# EasyEDA schematic SCH_Smart-Flower_2024-08-20 (easyeda STD).json
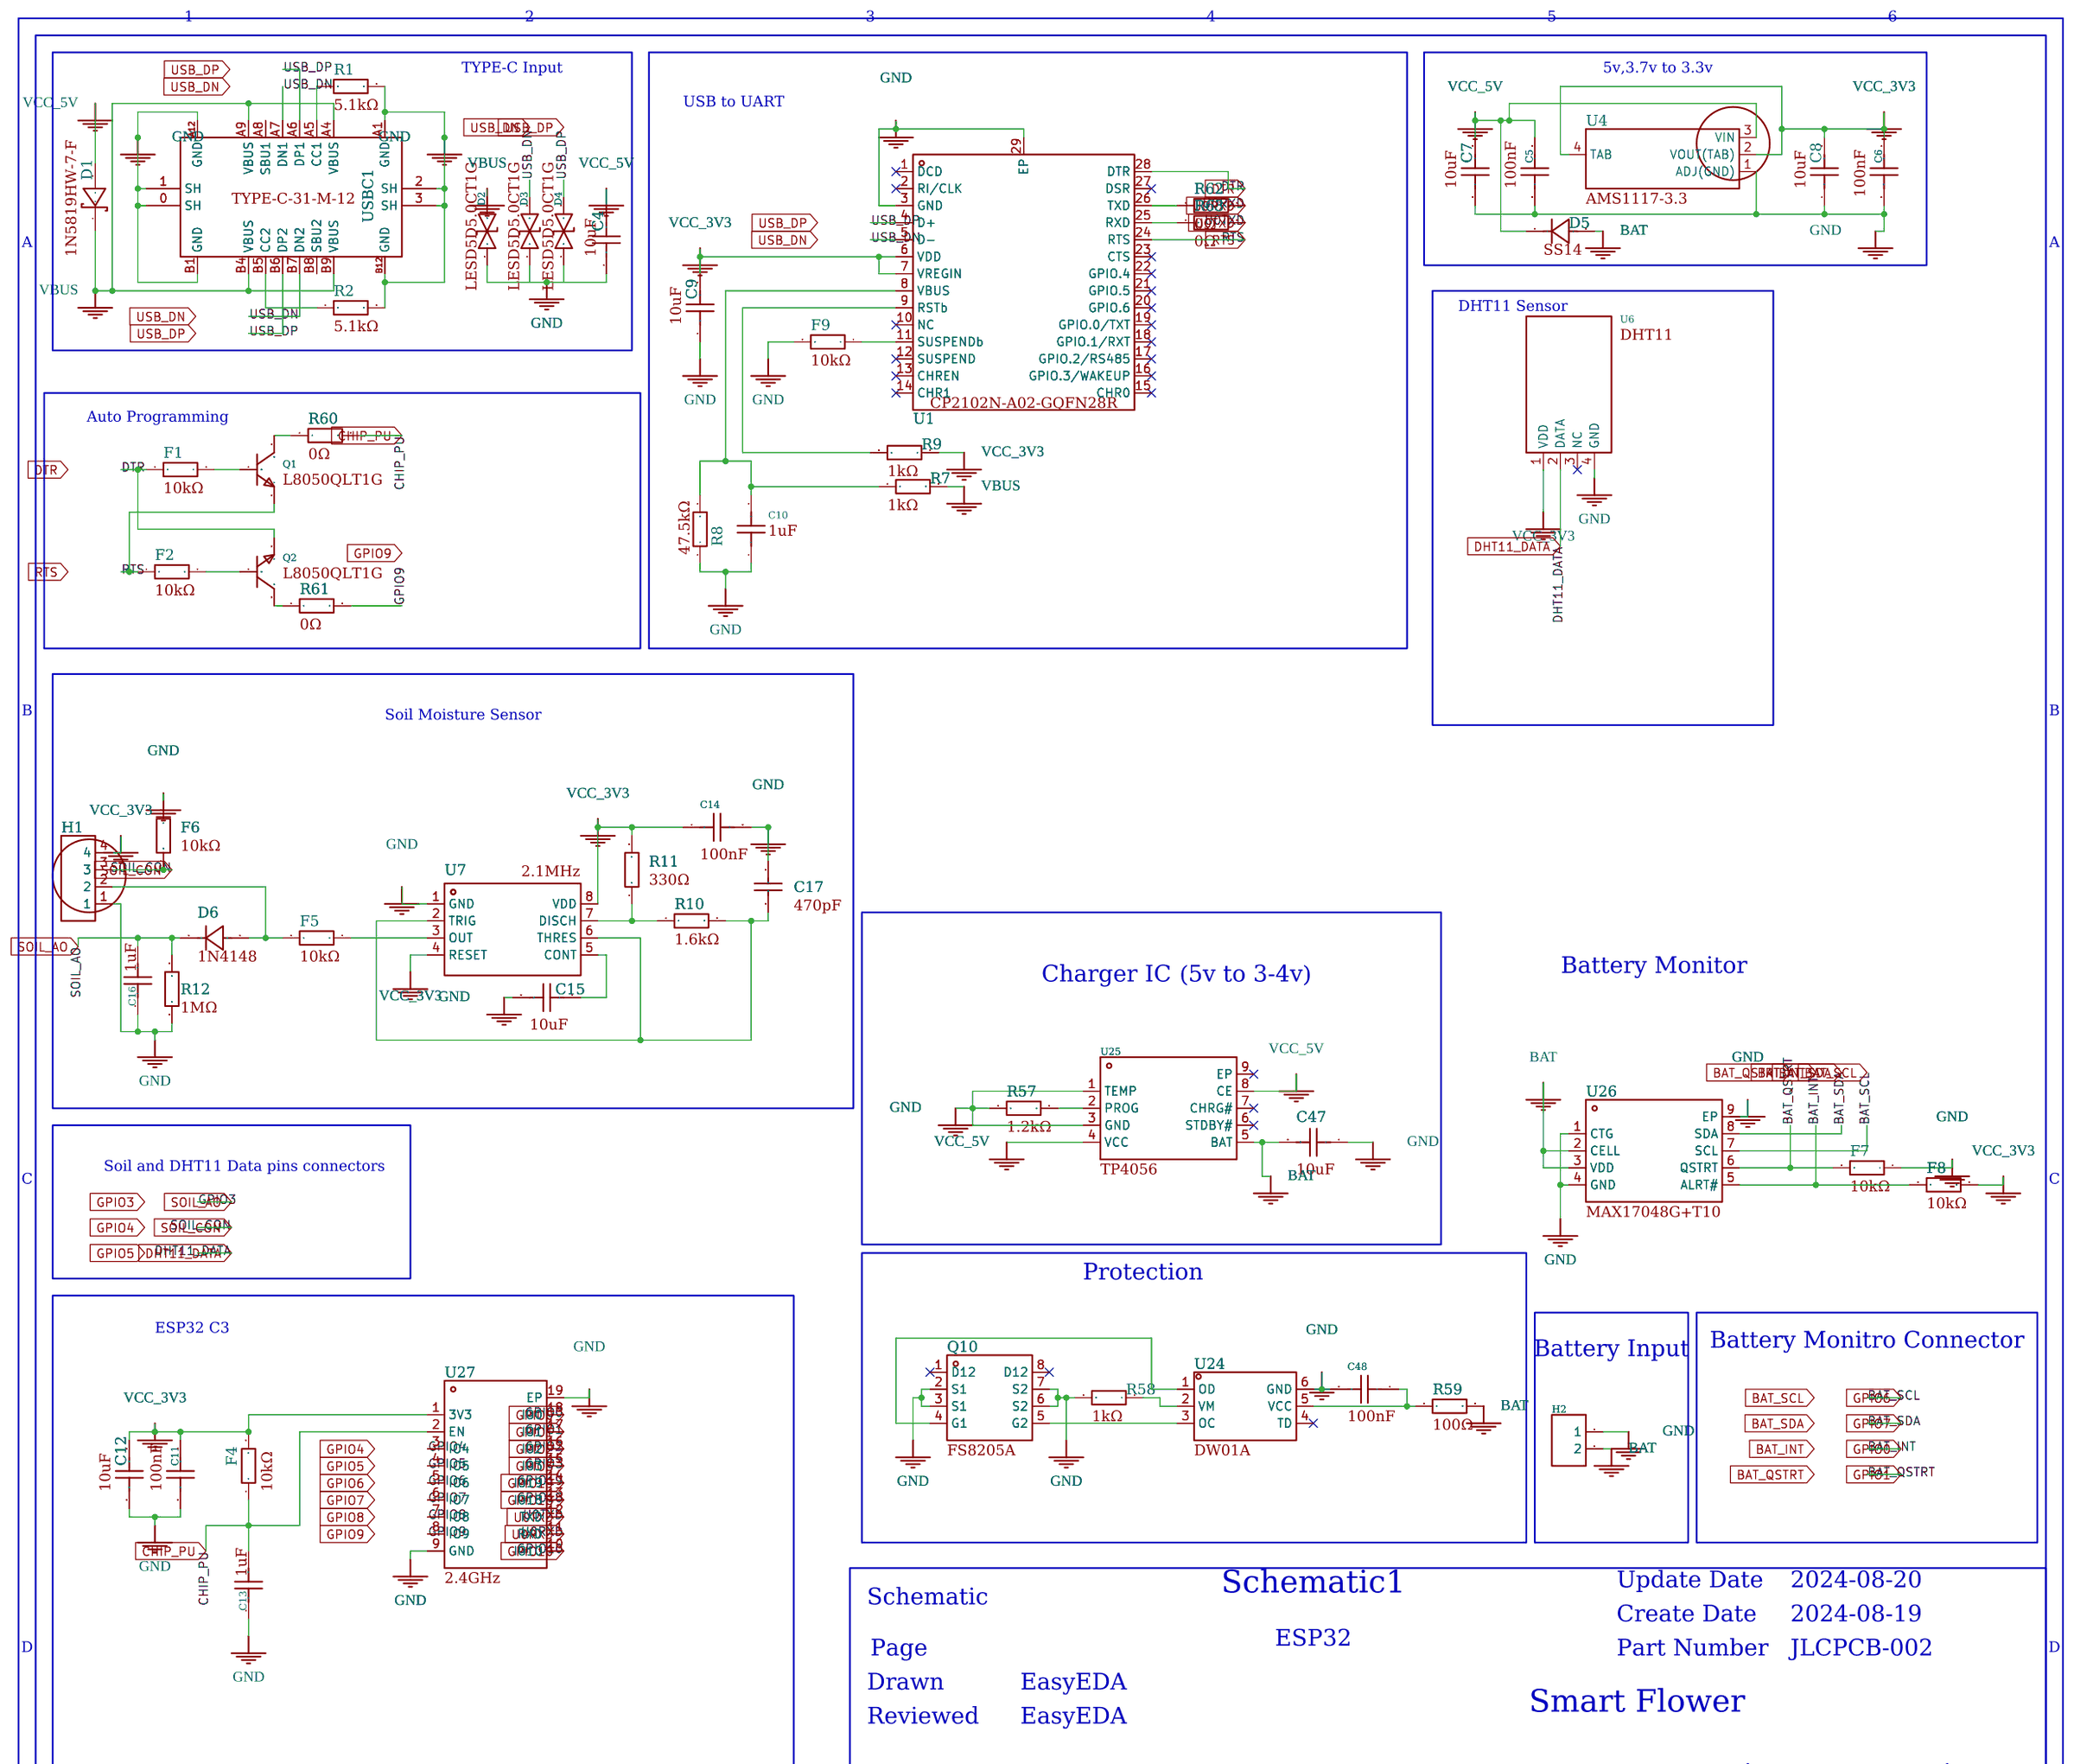
[diagram p0: schematic sheet]

## Parts
C4  10uF  [0]
C5  100nF  [0]
C6  100nF  [0]
C7  10uF  [0]
C8  10uF  [0]
C9  10uF  [0]
C10  1uF  [0]
C11  100nF  [0]
C12  10uF  [0]
C13  1uF  [0]
C14  100nF  [0]
C15  10uF  [0]
C16  1uF  [0]
C17  470pF  [0]
C47  10uF  [0]
C48  100nF  [0]
D1  1N5819HW-7-F  [0]
D2  LESD5D5.0CT1G  [0]
D3  LESD5D5.0CT1G  [0]
D4  LESD5D5.0CT1G  [0]
D5  SS14  [0]
D6  1N4148  [0]
F1  10kΩ  [0]
F2  10kΩ  [0]
F4  10kΩ  [0]
F5  10kΩ  [0]
F6  10kΩ  [0]
F7  10kΩ  [0]
F8  10kΩ  [0]
F9  10kΩ  [0]
H1  HDR-M_2.54_1x4P  [0]
H2  HDR-F_2.54_1x2P  [0]
Q1  L8050QLT1G  [0]
Q2  L8050QLT1G  [0]
Q10  FS8205A  [0]
R1  5.1kΩ  [0]
R2  5.1kΩ  [0]
R7  1kΩ  [0]
R8  47.5kΩ  [0]
R9  1kΩ  [0]
R10  1.6kΩ  [0]
R11  330Ω  [0]
R12  1MΩ  [0]
R57  1.2kΩ  [0]
R58  1kΩ  [0]
R59  100Ω  [0]
R60  0Ω  [0]
R61  0Ω  [0]
R62  0Ω  [0]
R63  0Ω  [0]
U1  CP2102N-A02-GQFN28R  [0]
U4  AMS1117-3.3  [0]
U6  DHT11  [0]
U7  2.1MHz  [0]
U24  DW01A  [0]
U25  TP4056  [0]
U26  MAX17048G+T10  [0]
U27  2.4GHz  [0]
USBC1  TYPE-C-31-M-12  [0]

## Library data of the parts
C4 C7-C9 C12 C15 C47 = -: Capacitance: Tolerance:±20% Tolerance:±20% Voltage Rated: Temperature Coefficient:; Symbol: 0603X106M250NT; Device: CL10A106MA8NRNC; LCSC Part Name: 10uF ±20% 25V; Supplier Part: C96446; Manufacturer: SAMSUNG(三星); Manufacturer Part: CL10A106MA8NRNC; Supplier Footprint: 0603; JLCPCB Part Class: Basic Part; Datasheet: https://atta.szlcsc.com/upload/public/pdf/source/20160218/1457707763339.pdf; Supplier: LCSC; Add into BOM: yes; Convert to PCB: yes; Tolerance: ±20%
C5 C6 C11 C14 C48 = -: Capacitance: Tolerance:±10% Tolerance:±10% Voltage Rated: Temperature Coefficient:; Symbol: CT41G-0805-2X1-50V-0.1UF-K(N); Device: CL21B104KCFNNNE; Supplier: LCSC; Supplier Part: C28233; Manufacturer: SAMSUNG(三星); Manufacturer Part: CL21B104KCFNNNE; JLCPCB Part Class: Basic Part; LCSC Part Name: 100nF ±10% 100V; Supplier Footprint: 0805; Datasheet: https://atta.szlcsc.com/upload/public/pdf/source/20160218/1457707763339.pdf; Add into BOM: yes; Convert to PCB: yes; Tolerance: ±10%
C10 C13 C16 = -: Capacitance: Tolerance:±10% Tolerance:±10% Voltage Rated: Temperature Coefficient:; Symbol: GRM188R71E105KA12D; Device: CL10A105KB8NNNC; Supplier: LCSC; Manufacturer: SAMSUNG(三星); Manufacturer Part: CL10A105KB8NNNC; Supplier Part: C15849; JLCPCB Part Class: Basic Part; LCSC Part Name: 1uF ±10% 50V; Supplier Footprint: 0603; Datasheet: https://atta.szlcsc.com/upload/public/pdf/source/20160218/1457707763339.pdf; Add into BOM: yes; Convert to PCB: yes; Tolerance: ±10%
C17 = -: Capacitance: Tolerance:±10% Tolerance:±10% Voltage Rated: Temperature Coefficient:; Symbol: 0603B471K101NT; Device: 0603B471K500NT; LCSC Part Name: 470pF ±10% 50V; Supplier Part: C1620; Manufacturer: FH(风华); Manufacturer Part: 0603B471K500NT; Supplier Footprint: 0603; JLCPCB Part Class: Basic Part; Datasheet: https://atta.szlcsc.com/upload/public/pdf/source/20200305/C486355_26A10D38EF8C2A5C37091D0039909270.pdf; Supplier: LCSC; Add into BOM: yes; Convert to PCB: yes; Tolerance: ±10%
D1 = -: Forward Voltage (Vf@If):450mV@1A Reverse Voltage (Vr):40V Average Rectified Current (Io):1A Reverse Leakage Current (Ir):1mA@40V; LCSC Part Name: 电压:40V 电流:1A; Supplier Part: C82544; Manufacturer: DIODES(美台); Supplier Footprint: SOD-123; JLCPCB Part Class: Extended Part; Datasheet: https://atta.szlcsc.com/upload/public/pdf/source/20161024/1477288459223.pdf; Supplier: LCSC; Add into BOM: yes; Convert to PCB: yes; Forward Voltage (Vf@If): 450mV@1A; Reverse Voltage (Vr): 40V; Average Rectified Current (Io): 1A; Reverse Leakage Current (Ir): 1mA@40V
D2-D4 = -: polarity:Bi-Directional Reverse Stand-Off Voltage (Vrwm):5V Maximum Clamping Voltage:18.6V Peak Pulse Current (Ipp)@10/1000us:9.4A Breakdown Voltage:5.6V Type:ESD; Supplier: LCSC; Supplier Part: C383211; Manufacturer: LRC(乐山无线电); JLCPCB Part Class: Extended Part; LCSC Part Name: 双向ESD; Supplier Footprint: SOD-523; Datasheet: https://atta.szlcsc.com/upload/public/pdf/source/20190807/C383211_633DF4B4E2C161403226E5235FE33A1C.pdf; Add into BOM: yes; Convert to PCB: yes; polarity: Bi-Directional; Reverse Stand-Off Voltage (Vrwm): 5V; Maximum Clamping Voltage: 18.6V; Peak Pulse Current (Ipp)@10/1000us: 9.4A; Breakdown Voltage: 5.6V; Type: ESD
D5 = -: Diode Configuration:Single Forward Voltage (Vf@If):550mV@1A Reverse Voltage (Vr):40V Rectified Current:1A Reverse Leakage Current (Ir):300uA@40V; Symbol: SS14_C2766061; Device: SS14_C2480; LCSC Part Name: 电压:40V 电流:1A; Supplier Part: C2480; Manufacturer: MDD(辰达半导体); Supplier Footprint: SMA(DO-214AC); JLCPCB Part Class: Basic Part; Datasheet: https://atta.szlcsc.com/upload/public/pdf/source/20230712/2DB6064CFBB99DE6DB116BEE8208BE66.pdf; Supplier: LCSC; Add into BOM: yes; Convert to PCB: yes; Diode Configuration: Single; Forward Voltage (Vf@If): 550mV@1A; Reverse Voltage (Vr): 40V; Rectified Current: 1A; Reverse Leakage Current (Ir): 300uA@40V; Average Rectified Current (Io): 1A; Peak forward surge current: 30A
D6 = -: Symbol: 1N4148_C18195411; Device: 1N4148_C18195411; Supplier Part: C18195411; Manufacturer: LJ(朗捷); Supplier Footprint: DO-35; JLCPCB Part Class: Extended Part; Datasheet: https://atta.szlcsc.com/upload/public/pdf/source/20230921/E18EF32AEA6D96127C0687F4453A915D.pdf; Supplier: LCSC; Add into BOM: yes; Convert to PCB: yes
F1 F2 F4-F9 = -: Type:Thick Film Resistors Resistance:10kΩ Tolerance:±1% Tolerance:±1% Power(Watts): Overload Voltage (Max): Temperature Coefficient:±100ppm/℃ Temperature Coefficient:±100ppm/℃ Operating Temperature Range:-55℃+155℃ Operating Temperature Range:-55℃+155℃; Symbol: RC0603FR-1310KL; Device: 0603WAF1002T5E; LCSC Part Name: 厚膜电阻 10kΩ ±1% 100mW; Supplier Part: C25804; Manufacturer: UNI-ROYAL(厚声); Manufacturer Part: 0603WAF1002T5E; Supplier Footprint: 0603; JLCPCB Part Class: Basic Part; Datasheet: https://atta.szlcsc.com/upload/public/pdf/source/20200306/C422600_1E6D84923E4A46A82E41ADD87F860B5C.pdf; Supplier: LCSC; Add into BOM: yes; Convert to PCB: yes; Type: Thick Film Resistors; Tolerance: ±1%; Temperature Coefficient: ±100ppm/℃; Operating Temperature Range: -55℃+155℃
H1 = -: Symbol: PZ254V-11-04P; Convert to PCB: yes; Add into BOM: No; Supplier Footprint: Through
H2 = -: Symbol: Header-Female-2.54_1x2; Supplier: LCSC; Manufacturer: BOOMELE(博穆精密); Manufacturer Part: 2.54-1*2P母; Supplier Part: C49661; JLCPCB Part Class: Extended Part; Convert to PCB: yes; Add into BOM: No; Supplier Footprint: Through
Q1 Q2 = -: Transistor Type: Collector Current (Ic): Collector-Emitter Breakdown Voltage (Vceo): Power Dissipation (Pd):; Supplier: LCSC; Manufacturer: LRC(乐山无线电); Supplier Part: C49581; JLCPCB Part Class: Extended Part; LCSC Part Name: 耐压:25V 电流:800mA NPN; Supplier Footprint: SOT-23; Datasheet: https://atta.szlcsc.com/upload/public/pdf/source/20150518/1457707314424.pdf; Add into BOM: yes; Convert to PCB: yes
Q10 = -: Type:2 N-Channel Drain Source Voltage (Vdss): Continuous Drain Current (Id): Power Dissipation (Pd): Drain Source On Resistance (RDS(on)@Vgs,Id):25mΩ@4.5V,4A Gate Threshold Voltage (Vgs(th)@Id):1V@250uA; Device: FS8205A_C16052; LCSC Part Name: 2个N沟道 耐压:20V 电流:6A; Supplier Part: C16052; Manufacturer: FORTUNE(富晶); Supplier Footprint: TSSOP-8; JLCPCB Part Class: Extended Part; Datasheet: https://atta.szlcsc.com/upload/public/pdf/source/20140228/1457706997167.pdf; Supplier: LCSC; Add into BOM: No; Convert to PCB: yes; Type: 2 N-Channel; Drain Source On Resistance (RDS(on)@Vgs,Id): 25mΩ@4.5V,4A; Gate Threshold Voltage (Vgs(th)@Id): 1V@250uA
R1 R2 = -: Type:Thick Film Resistors Resistance:5.1kΩ Tolerance:±1% Tolerance:±1% Power(Watts): Overload Voltage (Max): Temperature Coefficient:±100ppm/℃ Temperature Coefficient:±100ppm/℃ Operating Temperature Range:-55℃+155℃ Operating Temperature Range:-55℃+155℃; Symbol: RC0402DR-075K1L; Device: 0402WGF5101TCE; LCSC Part Name: 5.1kΩ ±1% 62.5mW 厚膜电阻; Supplier Part: C25905; Manufacturer: UNI-ROYAL(厚声); Manufacturer Part: 0402WGF5101TCE; Supplier Footprint: 0402; JLCPCB Part Class: Basic Part; Datasheet: https://atta.szlcsc.com/upload/public/pdf/source/20200306/C422600_1E6D84923E4A46A82E41ADD87F860B5C.pdf; Supplier: LCSC; Add into BOM: yes; Convert to PCB: yes; Type: Thick Film Resistors; Tolerance: ±1%; Temperature Coefficient: ±100ppm/℃; Operating Temperature Range: -55℃+155℃
R7 = -: Type:Thick Film Resistors Resistance:1kΩ Tolerance:±1% Tolerance:±1% Power(Watts): Overload Voltage (Max): Temperature Coefficient:±100ppm/℃ Temperature Coefficient:±100ppm/℃ Operating Temperature Range:-55℃+155℃ Operating Temperature Range:-55℃+155℃; Symbol: RTT022212FTH; Device: 0402WGF1001TCE; LCSC Part Name: 1kΩ ±1% 62.5mW 厚膜电阻; Supplier Part: C11702; Manufacturer: UNI-ROYAL(厚声); Manufacturer Part: 0402WGF1001TCE; Supplier Footprint: 0402; JLCPCB Part Class: Basic Part; Datasheet: https://atta.szlcsc.com/upload/public/pdf/source/20200306/C422600_1E6D84923E4A46A82E41ADD87F860B5C.pdf; Supplier: LCSC; Add into BOM: yes; Convert to PCB: yes; Type: Thick Film Resistors; Tolerance: ±1%; Temperature Coefficient: ±100ppm/℃; Operating Temperature Range: -55℃+155℃
R8 = -: Type:Thin Film Resistor Resistance: Tolerance:±0.5% Tolerance:±0.5% Power(Watts): Overload Voltage (Max): Temperature Coefficient:±50ppm/℃ Temperature Coefficient:±50ppm/℃ Operating Temperature Range:-55℃+155℃ Operating Temperature Range:-55℃+155℃; Symbol: AR02DTD4752; Device: AR02DTD4752; LCSC Part Name: 薄膜电阻 47.5kΩ ±0.5% 62.5mW; Supplier Part: C319604; Manufacturer: Viking(光颉); Manufacturer Part: AR02DTD4752; Supplier Footprint: 0402; JLCPCB Part Class: Extended Part; Datasheet: https://atta.szlcsc.com/upload/public/pdf/source/20191129/C465721_10D49275DB41E427863CE9C8D788770A.pdf; Supplier: LCSC; Add into BOM: yes; Convert to PCB: yes; Type: Thin Film Resistor; Tolerance: ±0.5%; Temperature Coefficient: ±50ppm/℃; Operating Temperature Range: -55℃+155℃
R9 R58 = -: Type:Thick Film Resistors Resistance:1kΩ Tolerance:±1% Tolerance:±1% Power(Watts): Overload Voltage (Max): Temperature Coefficient:±100ppm/℃ Temperature Coefficient:±100ppm/℃ Operating Temperature Range:-55℃+155℃ Operating Temperature Range:-55℃+155℃; Symbol: RS-03K102JT; Device: 0603WAF1001T5E; LCSC Part Name: 1kΩ ±1% 100mW 厚膜电阻; Supplier Part: C21190; Manufacturer: UNI-ROYAL(厚声); Manufacturer Part: 0603WAF1001T5E; Supplier Footprint: 0603; JLCPCB Part Class: Basic Part; Datasheet: https://atta.szlcsc.com/upload/public/pdf/source/20200306/C422600_1E6D84923E4A46A82E41ADD87F860B5C.pdf; Supplier: LCSC; Add into BOM: yes; Convert to PCB: yes; Type: Thick Film Resistors; Tolerance: ±1%; Temperature Coefficient: ±100ppm/℃; Operating Temperature Range: -55℃+155℃
R10 = -: Type:Thick Film Resistors Resistance: Tolerance:±5% Tolerance:±5% Power(Watts): Overload Voltage (Max): Temperature Coefficient:±100ppm/℃ Temperature Coefficient:±100ppm/℃ Operating Temperature Range:-55℃+155℃ Operating Temperature Range:-55℃+155℃; Symbol: RTT02162JTH; Device: RTT02162JTH; LCSC Part Name: 厚膜电阻 1.6kΩ ±5% 62.5mW; Supplier Part: C102832; Manufacturer: RALEC(旺诠); Manufacturer Part: RTT02162JTH; Supplier Footprint: 0402; JLCPCB Part Class: Extended Part; Datasheet: https://atta.szlcsc.com/upload/public/pdf/source/20191219/C158410_884373A5B7E1BC76BF57BC45A946C093.pdf; Supplier: LCSC; Add into BOM: yes; Convert to PCB: yes; Type: Thick Film Resistors; Tolerance: ±5%; Temperature Coefficient: ±100ppm/℃; Operating Temperature Range: -55℃+155℃
R11 = -: Type:Thick Film Resistors Resistance: Tolerance:±1% Tolerance:±1% Power(Watts): Overload Voltage (Max): Temperature Coefficient:±100ppm/℃ Temperature Coefficient:±100ppm/℃ Operating Temperature Range:-55℃+155℃ Operating Temperature Range:-55℃+155℃; Symbol: RTT03331JTP; Device: 0603WAF3300T5E; LCSC Part Name: 330Ω ±1% 100mW 厚膜电阻; Supplier Part: C23138; Manufacturer: UNI-ROYAL(厚声); Manufacturer Part: 0603WAF3300T5E; Supplier Footprint: 0603; JLCPCB Part Class: Basic Part; Datasheet: https://atta.szlcsc.com/upload/public/pdf/source/20200306/C422600_1E6D84923E4A46A82E41ADD87F860B5C.pdf; Supplier: LCSC; Add into BOM: yes; Convert to PCB: yes; Type: Thick Film Resistors; Tolerance: ±1%; Temperature Coefficient: ±100ppm/℃; Operating Temperature Range: -55℃+155℃
R12 = -: Type:Thick Film Resistors Resistance:1MΩ Tolerance:±1% Tolerance:±1% Power(Watts): Overload Voltage (Max): Temperature Coefficient:±100ppm/℃ Temperature Coefficient:±100ppm/℃ Operating Temperature Range:-55℃+155℃ Operating Temperature Range:-55℃+155℃; Symbol: RTT031004FTP; Device: 0603WAF1004T5E; LCSC Part Name: 1MΩ ±1% 100mW 厚膜电阻; Supplier Part: C22935; Manufacturer: UNI-ROYAL(厚声); Manufacturer Part: 0603WAF1004T5E; Supplier Footprint: 0603; JLCPCB Part Class: Basic Part; Datasheet: https://atta.szlcsc.com/upload/public/pdf/source/20200306/C422600_1E6D84923E4A46A82E41ADD87F860B5C.pdf; Supplier: LCSC; Add into BOM: yes; Convert to PCB: yes; Type: Thick Film Resistors; Tolerance: ±1%; Temperature Coefficient: ±100ppm/℃; Operating Temperature Range: -55℃+155℃
R57 = -: Type:Thick Film Resistors Resistance: Tolerance:±1% Tolerance:±1% Power(Watts): Overload Voltage (Max): Temperature Coefficient:±100ppm/℃ Temperature Coefficient:±100ppm/℃ Operating Temperature Range:-55℃+155℃ Operating Temperature Range:-55℃+155℃; Symbol: RC0402FR-071K2L; Device: RC0402FR-071K2L; LCSC Part Name: 厚膜电阻 1.2kΩ ±1% 62.5mW; Supplier Part: C138040; Manufacturer: YAGEO(国巨); Manufacturer Part: RC0402FR-071K2L; Supplier Footprint: 0402; JLCPCB Part Class: Extended Part; Datasheet: https://atta.szlcsc.com/upload/public/pdf/source/20181009/C309620_DA5935B6E1D48212CB7A533FE518B3C2.pdf; Supplier: LCSC; Add into BOM: yes; Convert to PCB: yes; Type: Thick Film Resistors; Tolerance: ±1%; Temperature Coefficient: ±100ppm/℃; Operating Temperature Range: -55℃+155℃
R59 = -: Type:Thick Film Resistors Resistance: Tolerance:±1% Tolerance:±1% Power(Watts): Overload Voltage (Max): Temperature Coefficient:±200ppm/℃ Temperature Coefficient:±200ppm/℃ Operating Temperature Range:-55℃+155℃ Operating Temperature Range:-55℃+155℃; Symbol: 0603WAF1000T5E; Device: 0603WAF1000T5E; LCSC Part Name: 100Ω ±1% 100mW 厚膜电阻; Supplier Part: C22775; Manufacturer: UNI-ROYAL(厚声); Manufacturer Part: 0603WAF1000T5E; Supplier Footprint: 0603; JLCPCB Part Class: Basic Part; Datasheet: https://atta.szlcsc.com/upload/public/pdf/source/20200306/C422600_1E6D84923E4A46A82E41ADD87F860B5C.pdf; Supplier: LCSC; Add into BOM: yes; Convert to PCB: yes; Type: Thick Film Resistors; Tolerance: ±1%; Temperature Coefficient: ±200ppm/℃; Operating Temperature Range: -55℃+155℃
R60-R63 = -: Type:Thick Film Resistors Resistance: Tolerance:±1% Tolerance:±1% Power(Watts): Overload Voltage (Max): Temperature Coefficient:±800ppm/℃ Temperature Coefficient:±800ppm/℃ Operating Temperature Range:-55℃+155℃ Operating Temperature Range:-55℃+155℃; Symbol: 0402WGJ0000TCE; Device: 0402WGF0000TCE; LCSC Part Name: 0Ω ±1% 62.5mW 厚膜电阻; Supplier Part: C17168; Manufacturer: UNI-ROYAL(厚声); Manufacturer Part: 0402WGF0000TCE; Supplier Footprint: 0402; JLCPCB Part Class: Basic Part; Datasheet: https://atta.szlcsc.com/upload/public/pdf/source/20200306/C422600_1E6D84923E4A46A82E41ADD87F860B5C.pdf; Supplier: LCSC; Add into BOM: yes; Convert to PCB: yes; Type: Thick Film Resistors; Tolerance: ±1%; Temperature Coefficient: ±800ppm/℃; Operating Temperature Range: -55℃+155℃
U1 = -: Applications Function:USB转UART Protocol:UART Supply Voltage:3V3.6V Supply Voltage:3V3.6V Operating Temperature:-40℃+85℃@(Ta) Operating Temperature:-40℃+85℃@(Ta); LCSC Part Name: USB 2.0全速功能控制器，USB收发器，振荡器和通用异步接收机/发射机(UART); Supplier Part: C964632; Manufacturer: SKYWORKS/SILICON LABS(芯科); Supplier Footprint: QFN-28-EP(5x5); JLCPCB Part Class: Extended Part; Datasheet: https://atta.szlcsc.com/upload/public/pdf/source/20201204/C964632_F2B790CC23A72455AEF523510305B30A.pdf; Supplier: LCSC; Add into BOM: yes; Convert to PCB: yes; Applications Function: USB转UART; Protocol: UART; Supply Voltage: 3V3.6V; Operating Temperature: -40℃+85℃@(Ta)
U4 = -: Output Type: Maximum Input Voltage:- Output Voltage:3.3V Output Voltage:3.3V MAX Output Current:1A Power Supply Rejection Ratio (PSRR):72dB@(120Hz) Dropout Voltage:1.3V@(800mA) standby current:- Noise:- Feature:- Operating Temperature:- Operating Temperat; Symbol: AMS1117-3.3_C347222; Device: AMS1117-3.3_C6186; LCSC Part Name: 输出3.3V 1A; Supplier Part: C6186; Manufacturer: AMS; Supplier Footprint: SOT-223; JLCPCB Part Class: Basic Part; Datasheet: https://atta.szlcsc.com/upload/public/pdf/source/20180727/C6186_7A095716F0823C02F1997A905E26C086.pdf; Supplier: LCSC; Add into BOM: yes; Convert to PCB: yes; Output Voltage: 3.3V; MAX Output Current: 1A; Power Supply Rejection Ratio (PSRR): 72dB@(120Hz); Dropout Voltage: 1.3V@(800mA); Output Polarity: Positive electrode; Number of Outputs: 1
U6 = -: Device: DHT11_C117051; Supplier: LCSC; Supplier Part: C117051; Manufacturer: 广州奥松; JLCPCB Part Class: Extended Part; LCSC Part Name: DHT11  电容式传感器; Supplier Footprint: SIP-4; Datasheet: https://atta.szlcsc.com/upload/public/pdf/source/20170703/1499081238365.pdf; Add into BOM: yes; Convert to PCB: yes
U7 = -: Frequency:2.1MHz Supply Voltage:2V15V Supply Voltage:2V15V Supply Current:360uA Operating Temperature:0℃+70℃ Operating Temperature:0℃+70℃; Symbol: TLC555CDR; Device: TLC555CDR; LCSC Part Name: TLC555CDR; Supplier Part: C6986; Manufacturer: TI(德州仪器); Manufacturer Part: TLC555CDR; Supplier Footprint: SOIC-8; JLCPCB Part Class: Extended Part; Datasheet: https://www.ti.com/cn/lit/gpn/tlc555; Supplier: LCSC; Add into BOM: yes; Convert to PCB: yes; Supply Voltage: 2V15V; Supply Current: 360uA; Operating Temperature: 0℃+70℃
U24 = -: Symbol: DW01A_C351410; Device: DW01A_C351410; Supplier Part: C351410; Manufacturer: PUOLOP(迪浦); Supplier Footprint: SOT-23-6L; JLCPCB Part Class: Extended Part; Datasheet: https://atta.szlcsc.com/upload/public/pdf/source/20190109/C351410_3E9B9491D1909DF24C48D1B9CD871392.pdf; Supplier: LCSC; Add into BOM: yes; Convert to PCB: yes
U25 = -: Symbol: TP4056_C382139; Device: TP4056_C382139; Supplier: LCSC; Supplier Part: C382139; Manufacturer: TPOWER(天源); JLCPCB Part Class: Extended Part; LCSC Part Name: 1A锂电池充电IC; Supplier Footprint: ESOP-8; Datasheet: https://atta.szlcsc.com/upload/public/pdf/source/20190327/C382139_EC85960E6FE3E26856C240C81751A184.pdf; Add into BOM: yes; Convert to PCB: yes
U26 = -: The Chip Type:电池监测芯片 Type of Battery:锂离子/Polymer Number of Cells:1 Number of Cells:1 Operating Temperature:-20℃+70℃ Operating Temperature:-20℃+70℃; Supplier Part: C2682616; Manufacturer: ADI(亚德诺)/MAXIM(美信); Supplier Footprint: DFN-8-EP(2x2); JLCPCB Part Class: Extended Part; Datasheet: https://atta.szlcsc.com/upload/public/pdf/source/20210106/C2682616_818568B5D3BA4B627110FCAA33E0BFB1.pdf; Supplier: LCSC; Add into BOM: yes; Convert to PCB: yes; The Chip Type: 电池监测芯片; Type of Battery: 锂离子/Polymer; Number of Cells: 1; Operating Temperature: -20℃+70℃
U27 = -: Core Processor:ESP32-C3芯片 Support Interface:I2C；GPIO；SPI；JTAG；UART；USB；I2S Frequency:2.4GHz Output Power:20.5dBm Output Power:20.5dBm; Symbol: ESP32-C3-WROOM-02-N4(4MB); Device: ESP32-C3-WROOM-02-N4_C2934560; LCSC Part Name: ESP32-C3-WROOM-02-N4; Supplier Part: C2934560; Manufacturer: ESPRESSIF(乐鑫); Manufacturer Part: ESP32-C3-WROOM-02-N4; Supplier Footprint: VFQFN-32-EP; JLCPCB Part Class: Extended Part; Datasheet: https://atta.szlcsc.com/upload/public/pdf/source/20220106/F07459EFFE1D7CBA94B4FB8A075146A6.pdf; Supplier: LCSC; Add into BOM: yes; Convert to PCB: yes; Core Processor: ESP32-C3芯片; Support Interface: I2C；GPIO；SPI；JTAG；UART；USB；I2S; Output Power: 20.5dBm
USBC1 = -: Connector Type:Type-C Standard:- Gender:Female Number of Ports:1 Number of Contacts:16P Mounting Style:- Current Rating - Power (Max):5A Contact Material:- Contact Plating:- Operating Temperature Range:- Operating Temperature Range:- Soldering Temperature; LCSC Part Name: Type-C 母; Supplier Part: C165948; Manufacturer: 韩国韩荣; Supplier Footprint: SMD; JLCPCB Part Class: Extended Part; Datasheet: https://atta.szlcsc.com/upload/public/pdf/source/20220525/466408E853115E789EDB0DDC29077C05.pdf; Supplier: LCSC; Add into BOM: yes; Convert to PCB: yes; Connector Type: Type-C; Gender: Female; Number of Ports: 1; Number of Contacts: 16P; Current Rating - Power (Max): 5A

## Nets
GND: C4.1 C5.2 C6.2 C7.1 C8.1 C9.1 C10.1 C11.2 C12.1 C13.1 C14.2 C15.2 C16.1 C17.2 C47.1 C48.2 D2.1 F6.1 F7.1 F9.2 H1.1 H2.1 Q10.2(S1) Q10.3(S1) Q10.6(S2) Q10.7(S2) R1.2 R2.2 R8.1 R12.1 R57.1 R58.2 U1.3(GND) U1.29(EP) U4.1(ADJ(GND)) U6.4(GND) U7.1(GND) U24.6(GND) U25.1(TEMP) U25.3(GND) U26.1(CTG) U26.4(GND) U26.9(EP) U27.9(GND) U27.19(EP) USBC1.0(SH) USBC1.1(SH) USBC1.2(SH) USBC1.3(SH) USBC1.A1(GND) USBC1.A12(GND) USBC1.B1(GND) USBC1.B12(GND)
VBUS: D1.1(K) D2.2 R7.2 USBC1.A4(VBUS) USBC1.A9(VBUS) USBC1.B4(VBUS) USBC1.B9(VBUS)
VCC_3V3: C6.1 C8.2 C9.2 C11.1 C12.2 C14.1 F4.2 F8.1 H1.4 R9.1 R11.2 U1.6(VDD) U1.7(VREGIN) U4.2(VOUT(TAB)) U4.4(TAB) U6.1(VDD) U7.4(RESET) U7.8(VDD) U27.1(3V3)
VCC_5V: C4.2 C5.1 C7.2 D1.2(A) D5.1(K) U4.3(VIN) U25.4(VCC) U25.8(CE)
BAT: C47.2 D5.2(A) H2.2 R59.2 U25.5(BAT) U26.2(CELL) U26.3(VDD)
BAT_INT: F8.2 U26.5(ALRT#) U27.18(IO0)
BAT_QSTRT: F7.2 U26.6(QSTRT) U27.17(IO1)
BAT_SCL: U26.7(SCL) U27.5(IO6)
BAT_SDA: U26.8(SDA) U27.6(IO7)
CHIP_PU: C13.2 F4.1 R60.2 U27.2(EN)
DHT11_DATA: U6.2(DATA) U27.4(IO5)
DTR: F1.1 Q2.2(E) U1.28(DTR)
GPIO2: U27.16(IO2)
GPIO3: C16.2 D6.2(C) R12.2 U27.15(IO3)
GPIO4: F6.2 H1.3 U27.3(IO4)
GPIO8: U27.7(IO8)
GPIO9: R61.2 U27.8(IO9)
GPIO10: U27.10(IO10)
GPIO18: U27.13(IO18)
GPIO19: U27.14(IO19)
RTS: F2.1 Q1.2(E) U1.24(RTS)
U0RXD: R62.2 U27.11(RXD)
U0TXD: R63.2 U27.12(TXD)
USB_DN: D3.2 U1.5(D-) USBC1.A7(DN1) USBC1.B7(DN2)
USB_DP: D4.2 U1.4(D+) USBC1.A6(DP1) USBC1.B6(DP2)
Net-(C10-2): C10.2 R7.1 R8.2 U1.8(VBUS)
Net-(C15-1): C15.1 U7.5(CONT)
Net-(C17-1): C17.1 R10.2 U7.2(TRIG) U7.6(THRES)
Net-(C48-1): C48.1 R59.1 U24.5(VCC)
Net-(D6-1): D6.1(A) F5.2 H1.2
Net-(F1-2): F1.2 Q1.1(B)
Net-(F2-2): F2.2 Q2.1(B)
Net-(F5-1): F5.1 U7.3(OUT)
Net-(F9-1): F9.1 U1.11(SUSPENDb)
Net-(Q1-3): Q1.3(C) R60.1
Net-(Q2-3): Q2.3(C) R61.1
Net-(Q10-4): Q10.4(G1) U24.1(OD)
Net-(Q10-5): Q10.5(G2) U24.3(OC)
Net-(R1-1): R1.1 USBC1.A5(CC1)
Net-(R2-1): R2.1 USBC1.B5(CC2)
Net-(R9-2): R9.2 U1.9(RSTb)
Net-(R10-1): R10.1 R11.1 U7.7(DISCH)
Net-(R57-2): R57.2 U25.2(PROG)
Net-(R58-1): R58.1 U24.2(VM)
Net-(R62-1): R62.1 U1.26(TXD)
Net-(R63-1): R63.1 U1.25(RXD)

Not connected (* = marked no-connect by the designer): D3 1; D4 1; Q10 1(D12)* 8(D12)*; U1 1(DCD)* 2(RI/CLK)* 10(NC)* 12(SUSPEND)* 13(CHREN)* 14(CHR1)* 15(CHR0)* 16(GPIO.3/WAKEUP)* 17(GPIO.2/RS485)* 18(GPIO.1/RXT)* 19(GPIO.0/TXT)* 20(GPIO.6)* 21(GPIO.5)* 22(GPIO.4)* 23(CTS)* 27(DSR)*; U6 3(NC)*; U24 4(TD)*; U25 6(STDBY#)* 7(CHRG#)* 9(EP)*; USBC1 A8(SBU1) B8(SBU2)

## Notes on the sheet
- 1
- 2
- 3
- 4
- 5
- 6
- TYPE-C Input
- 5v,3.7v to 3.3v
- USB to UART
- A
- A
- DHT11 Sensor
- Auto Programming
- B
- B
- Soil Moisture Sensor
- Charger IC (5v to 3-4v)
- Battery Monitor
- Soil and DHT11 Data pins connectors
- C
- C
- Protection
- ESP32 C3
- Battery Input
- Battery Monitro Connector
- Schematic1
- Update Date
- 2024-08-20
- Schematic
- Create Date
- 2024-08-19
- ESP32
- D
- Page
- Part Number
- JLCPCB-002
- D
- Drawn
- EasyEDA
- Smart Flower
- Reviewed
- EasyEDA
- VER
- SIZE
- 1
- 1
- PAGE
- OF
- V0.1
- 1
- 2
- 3
- 4
- 5
- 6
